# Altium project ESP32C3_Breakout.PrjPcb
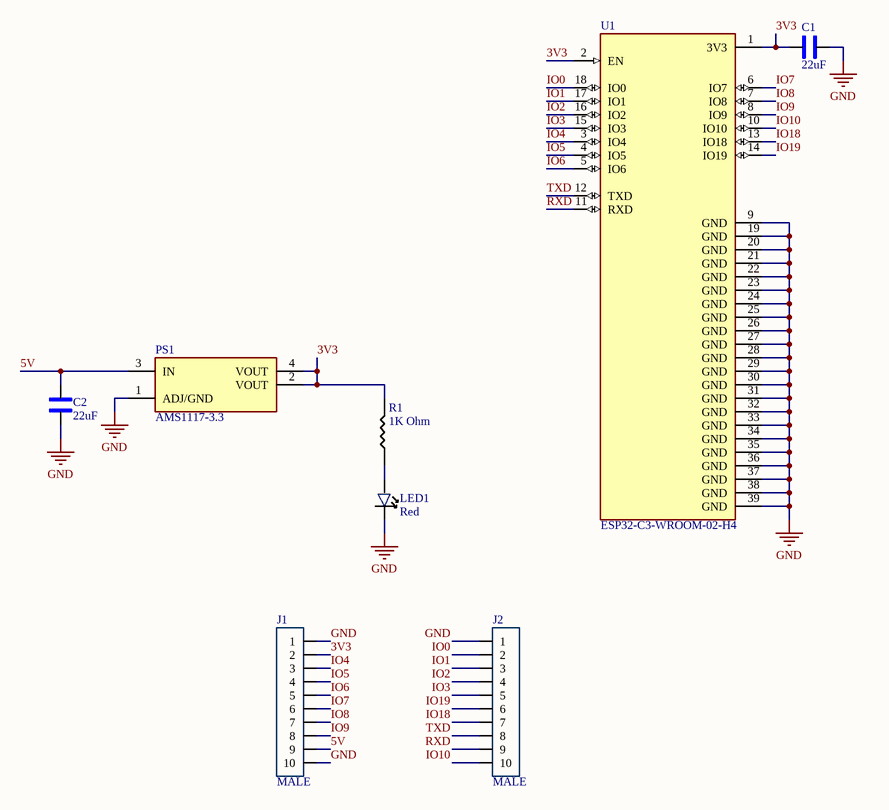
[diagram p0: ESP32Break_Schem.SchDoc]
1 sheet, 8 parts. Net scope: global (net labels, ports and power ports of the same name join across sheets).
Board file: ESP32Break_PCB.PcbDoc

## Sheet ESP32Break_Schem.SchDoc
size A; SheetNumber: 1; SheetTotal: 1

### Parts
C1  22uF  [1206_Passive_Capacitor]
C2  22uF  [1206_Passive_Capacitor]
J1  value MALE  [10_PIN_100MIL-Male]  (hidden comment: MALE 10PIN)
J2  value MALE  [10_PIN_100MIL-Male]  (hidden comment: MALE 10PIN)
LED1  Red  [LED_1206]
PS1  AMS1117-3.3  [LDO]
R1  value 1K Ohm  [1206_Passive_Resitor]  (hidden comment: 1k)
U1  ESP32-C3-WROOM-02-H4  [MODULE_ESP32-C3-WROOM-02-H4]

### Nets
GND: C1.2 C2.2 J1.1 J1.10 J2.1 LED1.2 PS1.1(ADJ/GND) U1.9(GND) U1.19(GND) U1.20(GND) U1.21(GND) U1.22(GND) U1.23(GND) U1.24(GND) U1.25(GND) U1.26(GND) U1.27(GND) U1.28(GND) U1.29(GND) U1.30(GND) U1.31(GND) U1.32(GND) U1.33(GND) U1.34(GND) U1.35(GND) U1.36(GND) U1.37(GND) U1.38(GND) U1.39(GND)
3V3: C1.1 J1.2 PS1.2(VOUT) PS1.4(VOUT) R1.2 U1.1(3V3) U1.2(EN)
5V: C2.1 J1.9 PS1.3(IN)
IO0: J2.2 U1.18(IO0)
IO1: J2.3 U1.17(IO1)
IO2: J2.4 U1.16(IO2)
IO3: J2.5 U1.15(IO3)
IO4: J1.3 U1.3(IO4)
IO5: J1.4 U1.4(IO5)
IO6: J1.5 U1.5(IO6)
IO7: J1.6 U1.6(IO7)
IO8: J1.7 U1.7(IO8)
IO9: J1.8 U1.8(IO9)
IO10: J2.10 U1.10(IO10)
IO18: J2.7 U1.13(IO18)
IO19: J2.6 U1.14(IO19)
RXD: J2.9 U1.11(RXD)
TXD: J2.8 U1.12(TXD)
NetLED1_1: LED1.1 R1.1

### Library data of the parts
C1 C2 = C_22uF_1206: 22uF ±10% 25V X5R 1206 Multilayer Ceramic Capacitors MLCC - SMD/SMT RoHS; MFR Part #: CL31A226KAHNNNE; Type: basic; LCSC Part#: C12891; Datasheet: https://datasheet.lcsc.com/lcsc/1811031514_Samsung-Electro-Mechanics-CL31A226KAHNNNE_C12891.pdf; Value: 22uF
J1 J2 = JM_10_PIN_MALE: Pin Header 10 1 Straight ，180degrees 2.54mm Through Hole,P=2.54mm Pin Header & Female Header RoHS; LCSC Part#: C124372; Type: Extended; Datasheet: https://datasheet.lcsc.com/szlcsc/1810241611_Ckmtw-Shenzhen-Cankemeng-C124372_C124372.pdf
LED1 = LED_RED_1206: Red 621~631nm 1206 Light Emitting Diodes (LED) RoHS; MFR Part #: 15-21/R6C-FQ1R1B/2T; Type: Extended; LCSC Part#: C93133; Datasheet: https://datasheet.lcsc.com/szlcsc/1811151241_Everlight-Elec-15-21-R6C-FQ1R1B-2T_C93133.pdf; Value: Red
PS1 = PS_AMS_LDO_3v3: LOW DROPOUT REGULATORS(LDO) POSITIVE FIXED 1.3V @ 800MA 15V 3.3V 1A SOT-223 ROHS; Value: IC REG LINEAR 3.3V 800MA SOT223; MFR Part #: AMS1117-3.3; LCSC Part#: C6186; Type: Basic
R1 = R_1K_1206: CHIP RESISTOR - SURFACE MOUNT 1KOHMS ±1% 1/4W 1206 ROHS; MFR Part #: RNCP1206FTD1K00CT; Digikey Link: https://www.digikey.com/product-detail/en/RNCP1206FTD1K00/RNCP1206FTD1K00CT-ND/2240675/?itemSeq=304982373; LCSC Part#: C4410; Type: Basic
U1 = ESP32-C3-WROOM-02-H4: WiFi Modules (802.11) (Engineering Samples) SMD module, ESP32-C3, 4MB SPI flash, PCB antenna, -40 C +105 C; MF: Espressif Systems; MP: ESP32-C3-WROOM-02-H4; Package: Package; Purchase-URL: https://pricing.snapeda.com/search/part/ESP32-C3-WROOM-02-H4/?ref=eda; Check_prices: https://www.snapeda.com/parts/ESP32-C3-WROOM-02-H4/Espressif+Systems/view-part/?ref=eda; SnapEDA_Link: https://www.snapeda.com/parts/ESP32-C3-WROOM-02-H4/Espressif+Systems/view-part/?ref=snap; Price: None; Availability: In Stock; Value: *